# EAGLE schematic encoder_board (EAGLE 9.6.2)
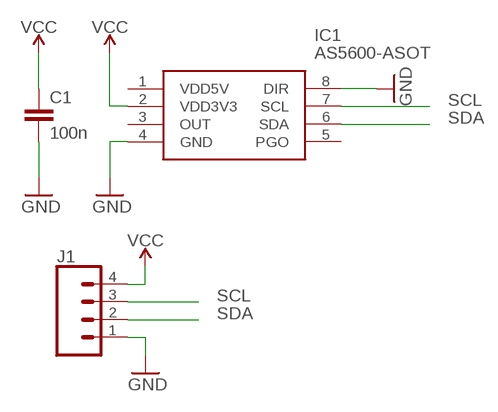
[diagram p0: schematic, sheet 1]

## Parts
C1  100n  C-EUC0805  [C0805]
IC1  AS5600-ASOT  [SOIC127P600X175-8N]
J1  CONN_04LONGPADS  [1X04_LONGPADS]

## Nets
GND: C1.2 IC1.4(GND) IC1.8(DIR) J1.1
SCL: IC1.7(SCL) J1.3
SDA: IC1.6(SDA) J1.2
VCC: C1.1 IC1.2(VDD3V3) J1.4
Unconnected: IC1.1(VDD5V) IC1.3(OUT) IC1.5(PGO)

## Library data of the parts
C1 = rcl:C-EU: CAPACITOR, European symbol; SPICEPREFIX: C
IC1 = AS5600:AS5600-ASOT: Board Mount Hall Effect / Magnetic Sensors AS5600 Magnetic Sensor 12-Bit Source: Datasheet <http://www.ams.com/eng/content/download/639463/1698857/325295>; DESCRIPTION: Board Mount Hall Effect / Magnetic Sensors AS5600 Magnetic Sensor 12-Bit; HEIGHT: 1.75mm; MANUFACTURER_NAME: ams; MANUFACTURER_PART_NUMBER: AS5600-ASOT; MOUSER_PART_NUMBER: 985-AS5600-ASOT; MOUSER_PRICE-STOCK: https://www.mouser.com/Search/Refine.aspx?Keyword=985-AS5600-ASOT
J1 = SparkFun-Connectors:CONN_04: Multi connection point. Often used as Generic Header-pin footprint for 0.1 inch spaced/style header connections On any of the 0.1 inch spaced packages, you can populate with these: Break Away Headers - Straight <https://www.sparkfun.com/products/116> (PRT-00116) Break Away Male Headers - Right Angle <https://www.sparkfun.com/products/553> (PRT-00553) Female Headers <https://www.sparkfun.com/products/115> (PRT-00115) Break Away Headers - Machine Pin <https://www.sparkfun.com/products/117> (PRT-00117) Break Away Female Headers - Swiss Machine Pin <https://www.sparkfun.com/products/743> (PRT-00743) For SCREWTERMINALS and SPRING TERMINALS visit here: Screw Terimnals on SparkFun.com <https://www.sparkfun.com/search/results?term=Screw+Terminals> (5mm/3.5mm/2.54mm spacing) This device is also useful as a general connection point to wire up your design to another part of your project. Our various solder wires solder well into these plated through hole pads. Hook-Up Wire - Assortment (Stranded, 22 AWG) <https://www.sparkfun.com/products/11375> (PRT-11375) Hook-Up Wire - Assortment (Solid Core, 22 AWG) <https://www.sparkfun.com/products/11367> (PRT-11367) View the entire wire category on our website here <https://www.sparkfun.com/categories/141> Special notes: Molex polarized connector foot print use with SKU : PRT-08231 with associated crimp pins and housings. 1MM SMD Version SKU: PRT-10208; PROD_ID: CONN-09696